# Altium project projet_pcb_F103.PrjPCB
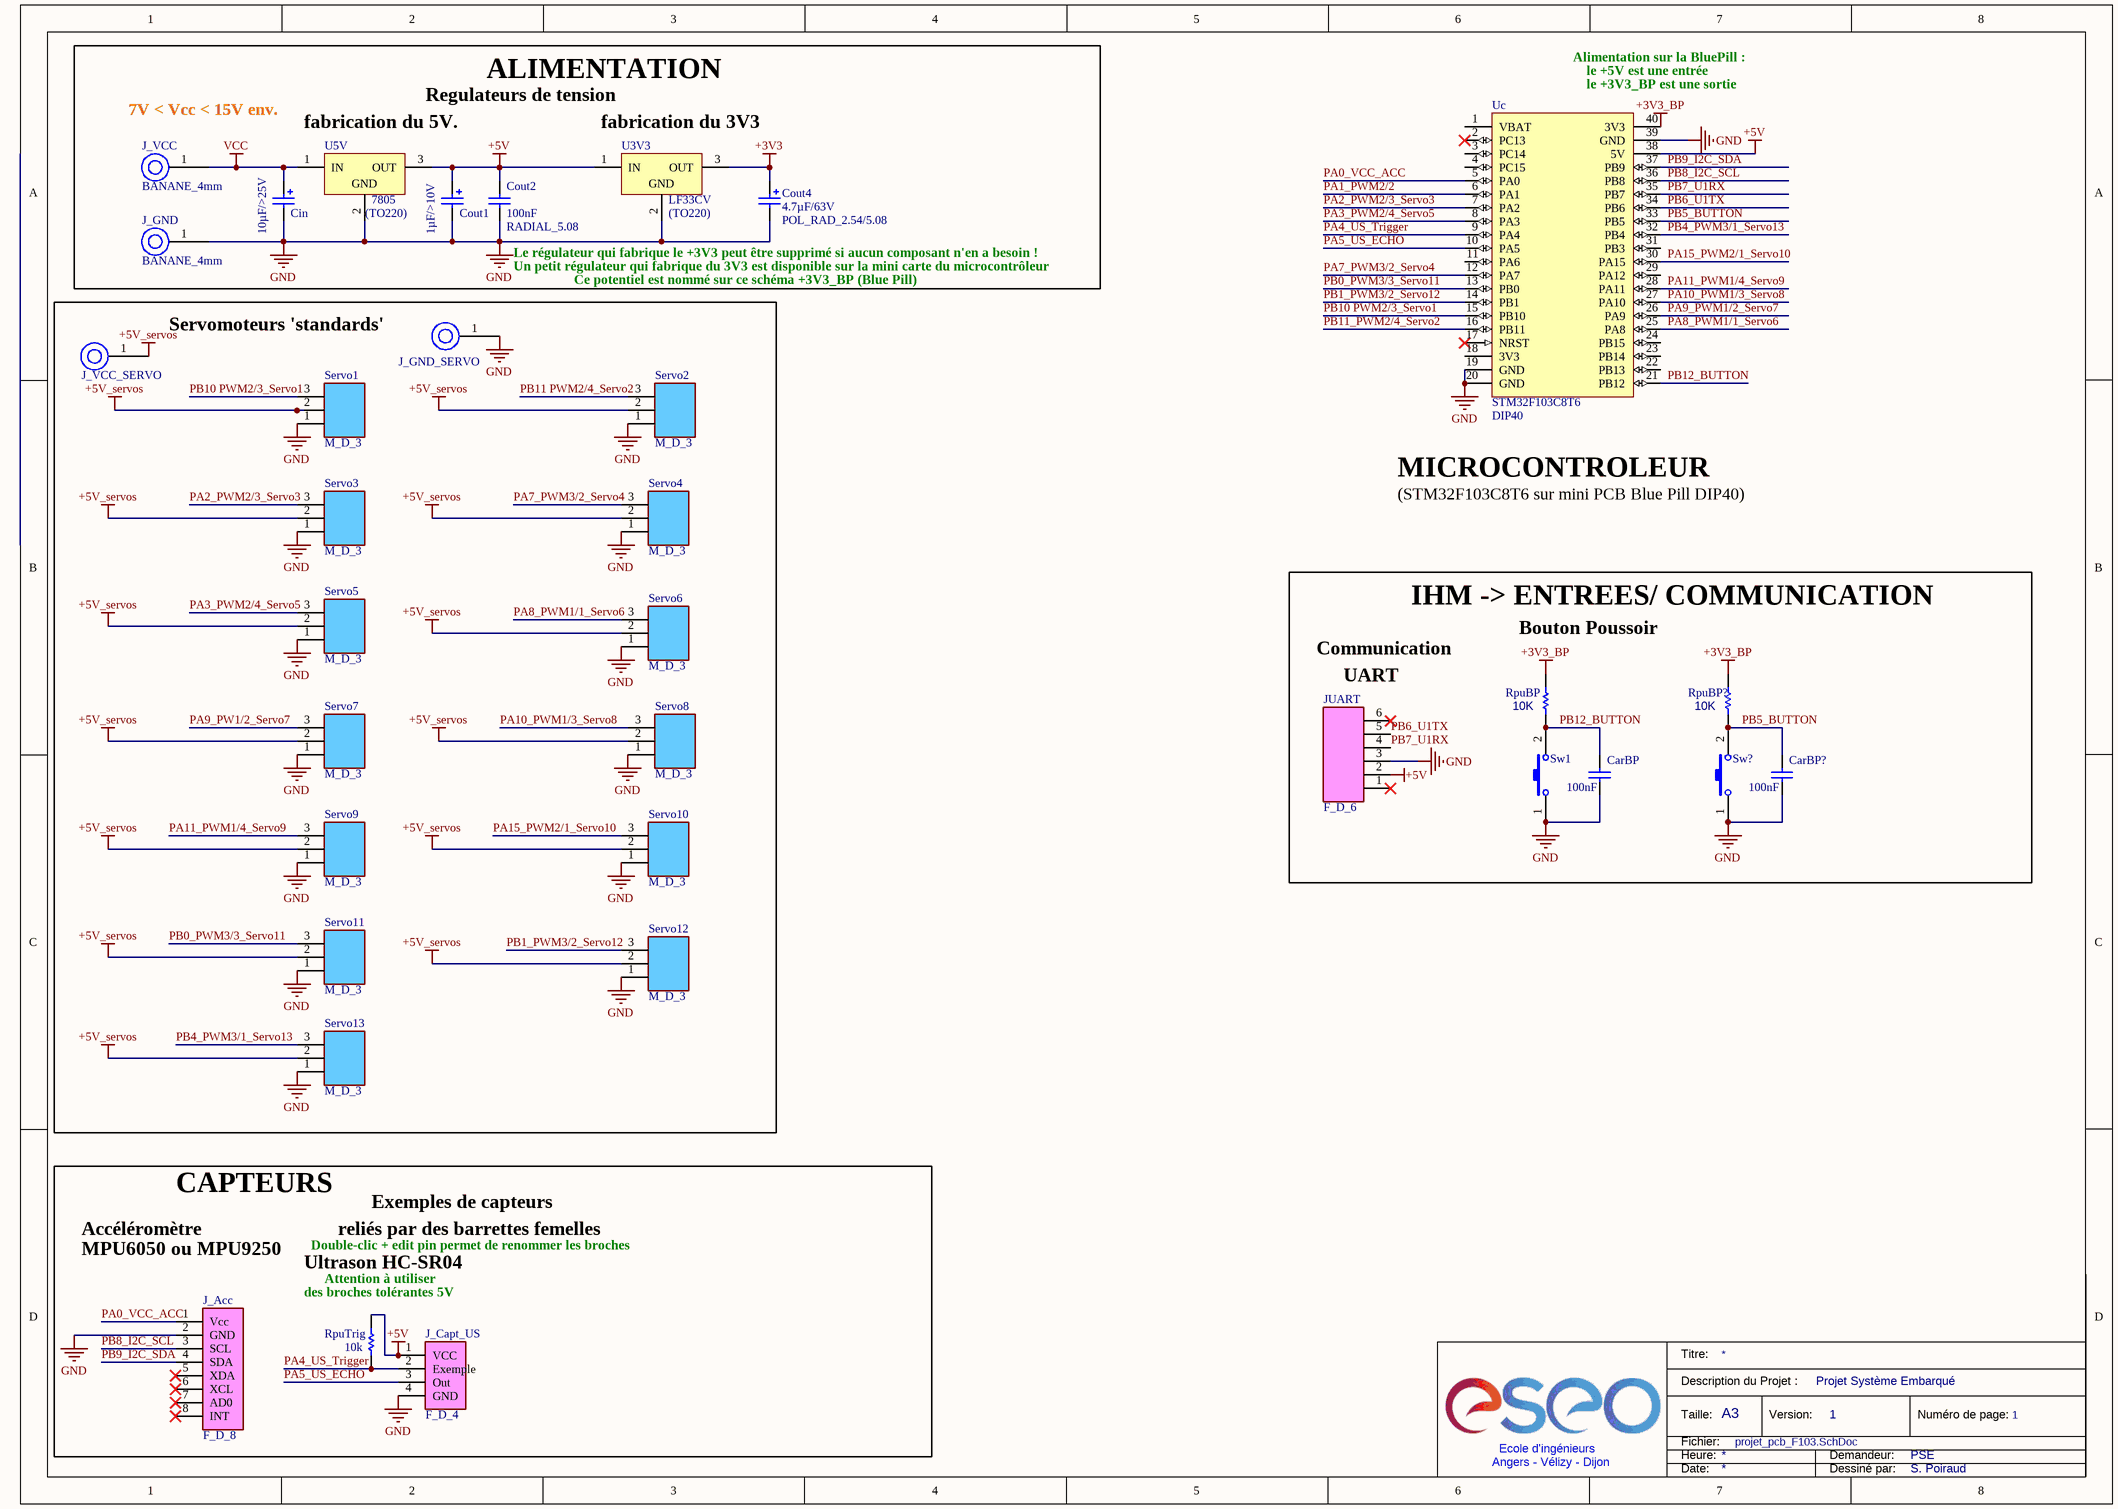
[diagram p0: projet_pcb_F103.SchDoc]
1 sheet, 34 parts. Net scope: global (net labels, ports and power ports of the same name join across sheets).
Board file: projet_pcb_F103.PCBDOC

## Sheet projet_pcb_F103.SchDoc
size A3

### Parts
CarBP  value 100nF  [CONDENSATEUR_CERAMIQUE_RADIAL_5.08]  (hidden comment: CONDENSATEUR_CER_RAD_5.08)
CarBP?  value 100nF  [CONDENSATEUR_CERAMIQUE_RADIAL_5.08]  (hidden comment: CONDENSATEUR_CER_RAD_5.08)
Cin  value 10µF/>25V  [CONDENSATEUR_POLARISE_ELECTROLYTIQUE_RADIAL_2.0/5.08]  (hidden comment: CONDENSATEUR_POL_ELECTROLY_RAD_2.0/5.08)
Cout1  value 1µF/>10V  [CONDENSATEUR_POLARISE_ELECTROLYTIQUE_RADIAL_2.0/5.08]  (hidden comment: CONDENSATEUR_POL_ELECTROLY_RAD_2.0/5.08)
Cout2  value 100nF  Type: RADIAL_5.08  [CONDENSATEUR_CERAMIQUE_RADIAL_5.08]  (hidden comment: CONDENSATEUR_CER_RAD_5.08)
Cout4  value 4.7µF/63V  Type: POL_RAD_2.54/5.08  [CONDENSATEUR_POLARISE_ELECTROLYTIQUE_RADIAL_2.54/5.08]  (hidden comment: CONDENSATEUR_POL_ELECTROLY_RAD_2.54/5.08)
J_Acc  Type: F_D_8  [BARRETTE_8_F_D]  (hidden comment: BARRETTE_8 CONTACTS_1 RANGEE_FEMELLE_DROITE)
J_Capt_US  Type: F_D_4  [BARRETTE_4_F_D]  (hidden comment: BARRETTE_4 CONTACTS_1 RANGEE_FEMELLE_DROITE)
J_GND  Type: BANANE_4mm  [DOUILLE_BANANE_4mm]  (hidden comment: DOUILLE BANANE 4mm)
J_GND_SERVO  DOUILLE BANANE 4mm  [DOUILLE_BANANE_4mm]  (value not drawn)
J_VCC  Type: BANANE_4mm  [DOUILLE_BANANE_4mm]  (hidden comment: DOUILLE BANANE 4mm)
J_VCC_SERVO  DOUILLE BANANE 4mm  [DOUILLE_BANANE_4mm]  (value not drawn)
JUART  Type: F_D_6  [BARRETTE_6_F_D]  (hidden comment: BARRETTE_6 CONTACTS_1 RANGEE_FEMELLE_DROITE)
RpuBP  value 10K  [RESISTANCE_1/4W]  (hidden comment: RESISTANCE_AXIALE_1/4W)
RpuBP?  value 10K  [RESISTANCE_1/4W]  (hidden comment: RESISTANCE_AXIALE_1/4W)
RpuTrig  10k  [RESISTANCE_1/4W]
Servo1  Type: M_D_3  [BARRETTE_3_M_D]  (hidden comment: BARRETTE 3 CONTACTS 1 RANGEE MALE DROITE)
Servo2  Type: M_D_3  [BARRETTE_3_M_D]  (hidden comment: BARRETTE 3 CONTACTS 1 RANGEE MALE DROITE)
Servo3  Type: M_D_3  [BARRETTE_3_M_D]  (hidden comment: BARRETTE 3 CONTACTS 1 RANGEE MALE DROITE)
Servo4  Type: M_D_3  [BARRETTE_3_M_D]  (hidden comment: BARRETTE 3 CONTACTS 1 RANGEE MALE DROITE)
Servo5  Type: M_D_3  [BARRETTE_3_M_D]  (hidden comment: BARRETTE 3 CONTACTS 1 RANGEE MALE DROITE)
Servo6  Type: M_D_3  [BARRETTE_3_M_D]  (hidden comment: BARRETTE 3 CONTACTS 1 RANGEE MALE DROITE)
Servo7  Type: M_D_3  [BARRETTE_3_M_D]  (hidden comment: BARRETTE 3 CONTACTS 1 RANGEE MALE DROITE)
Servo8  Type: M_D_3  [BARRETTE_3_M_D]  (hidden comment: BARRETTE 3 CONTACTS 1 RANGEE MALE DROITE)
Servo9  Type: M_D_3  [BARRETTE_3_M_D]  (hidden comment: BARRETTE 3 CONTACTS 1 RANGEE MALE DROITE)
Servo10  Type: M_D_3  [BARRETTE_3_M_D]  (hidden comment: BARRETTE 3 CONTACTS 1 RANGEE MALE DROITE)
Servo11  Type: M_D_3  [BARRETTE_3_M_D]  (hidden comment: BARRETTE 3 CONTACTS 1 RANGEE MALE DROITE)
Servo12  Type: M_D_3  [BARRETTE_3_M_D]  (hidden comment: BARRETTE 3 CONTACTS 1 RANGEE MALE DROITE)
Servo13  Type: M_D_3  [BARRETTE_3_M_D]  (hidden comment: BARRETTE 3 CONTACTS 1 RANGEE MALE DROITE)
Sw1  BOUTON_POUSSOIR_MINIATURE_TRAVERSANT  [BOUTON_POUSSE_PLAT_6x6]  (value not drawn)
Sw?  BOUTON_POUSSOIR_MINIATURE_TRAVERSANT  [BOUTON_POUSSE_PLAT_6x6]  (value not drawn)
U3V3  Type: LF33CV  Package: (TO220)  [REGULATEUR_TO220_78XX]  (hidden comment: REGULATEUR_TO220_78XX)
U5V  Type: 7805  Package: (TO220)  [REGULATEUR_TO220_78XX]  (hidden comment: REGULATEUR_TO220_78XX)
Uc  Type: STM32F103C8T6  Package: DIP40  [STM32F103C8T6_DIP40]  (hidden comment: STM32F103C8T6/PCB_DIP40)

### Blocks framed on the sheet
ALIMENTATION: Cin Cout1 Cout2 Cout4 J_GND J_VCC U3V3 U5V
Servomoteurs 'standards': J_GND_SERVO J_VCC_SERVO Servo1-Servo13
IHM -> ENTREES/ COMMUNICATION: CarBP CarBP? JUART RpuBP RpuBP? Sw1 Sw?
CAPTEURS: J_Acc J_Capt_US RpuTrig

### Nets
+3V3: Cout4.1 U3V3.3(OUT)
+3V3_BP: RpuBP.1 RpuBP?.1 Uc.40(3V3)
+5V: Cout1.1 Cout2.2 J_Capt_US.1(VCC) JUART.2 RpuTrig.2 U3V3.1(IN) U5V.3(OUT) Uc.38(5V)
+5V_servos: J_VCC_SERVO.1 Servo1.2 Servo2.2 Servo3.2 Servo4.2 Servo5.2 Servo6.2 Servo7.2 Servo8.2 Servo9.2 Servo10.2 Servo11.2 Servo12.2 Servo13.2
GND: CarBP.1 CarBP?.1 Cin.2 Cout1.2 Cout2.1 Cout4.2 J_Acc.2(GND) J_Capt_US.4(GND) J_GND.1 J_GND_SERVO.1 JUART.3 Servo1.1 Servo2.1 Servo3.1 Servo4.1 Servo5.1 Servo6.1 Servo7.1 Servo8.1 Servo9.1 Servo10.1 Servo11.1 Servo12.1 Servo13.1 Sw1.1 Sw?.1 U3V3.2(GND) U5V.2(GND) Uc.19(GND) Uc.20(GND) Uc.39(GND)
VCC: Cin.1 J_VCC.1 U5V.1(IN)
PA0_VCC_ACC: J_Acc.1(Vcc) Uc.5(PA0)
PA1_PWM2/2: Uc.6(PA1)
PA2_PWM2/3_Servo3: Servo3.3 Uc.7(PA2)
PA3_PWM2/4_Servo5: Servo5.3 Uc.8(PA3)
PA4_US_Trigger: J_Capt_US.2(Exemple) RpuTrig.1 Uc.9(PA4)
PA5_US_ECHO: J_Capt_US.3(Out) Uc.10(PA5)
PA7_PWM3/2_Servo4: Servo4.3 Uc.12(PA7)
PA8_PWM1/1_Servo6: Servo6.3 Uc.25(PA8)
PA9_PW1/2_Servo7: Servo7.3
PA9_PWM1/2_Servo7: Uc.26(PA9)
PA10_PWM1/3_Servo8: Servo8.3 Uc.27(PA10)
PA11_PWM1/4_Servo9: Servo9.3 Uc.28(PA11)
PA15_PWM2/1_Servo10: Servo10.3 Uc.30(PA15)
PB0_PWM3/3_Servo11: Servo11.3 Uc.13(PB0)
PB1_PWM3/2_Servo12: Servo12.3 Uc.14(PB1)
PB4_PWM3/1_Servo13: Servo13.3 Uc.32(PB4)
PB5_BUTTON: CarBP?.2 RpuBP?.2 Sw?.2 Uc.33(PB5)
PB6_U1TX: JUART.5 Uc.34(PB6)
PB7_U1RX: JUART.4 Uc.35(PB7)
PB8_I2C_SCL: J_Acc.3(SCL) Uc.36(PB8)
PB9_I2C_SDA: J_Acc.4(SDA) Uc.37(PB9)
PB10 PWM2/3_Servo1: Servo1.3 Uc.15(PB10)
PB11 PWM2/4_Servo2: Servo2.3
PB11_PWM2/4_Servo2: Uc.16(PB11)
PB12_BUTTON: CarBP.2 RpuBP.2 Sw1.2 Uc.21(PB12)

Not connected (* = marked no-connect by the designer): J_Acc 5(XDA)* 6(XCL)* 7(AD0)* 8(INT)*; JUART 1* 6*; Uc 1(VBAT) 2(PC13)* 3(PC14) 4(PC15) 11(PA6) 17(NRST)* 18(3V3) 22(PB13) 23(PB14) 24(PB15) 29(PA12) 31(PB3)

### Notes on the sheet
- Regulateurs de tension
- Alimentation sur la BluePill :
- (near Uc) le +3V3_BP est une sortie
- (near Uc) le +5V est une entrée
- 7V < Vcc < 15V env.
- (near U5V) fabrication du 5V.
- (near U3V3) fabrication du 3V3
- Le régulateur qui fabrique le +3V3 peut être supprimé si aucun composant n'en a besoin !
- Un petit régulateur qui fabrique du 3V3 est disponible sur la mini carte du microcontrôleur
- Ce potentiel est nommé sur ce schéma +3V3_BP (Blue Pill)
- MICROCONTROLEUR
- (STM32F103C8T6 sur mini PCB Blue Pill DIP40)
- (near RpuBP) Bouton Poussoir
- Communication
- (near JUART) UART
- Accéléromètre
- MPU6050 ou MPU9250
- Double-clic + edit pin permet de renommer les broches
- reliés par des barrettes femelles
- Exemples de capteurs
- Ultrason HC-SR04
- (near RpuTrig) des broches tolérantes 5V
- (near RpuTrig) Attention à utiliser
- Titre:
- Description du Projet :
- Projet Système Embarqué
- Ecole d'ingénieurs
- Taille:
- Heure:
- Fichier:
- A3
- Version:
- 1
- Demandeur:
- PSE
- Numéro de page:
- Angers - Vélizy - Dijon
- Date:
- Dessiné par:
- S. Poiraud

### Library data of the parts
CarBP CarBP? Cout2 = CONDENSATEUR_CER_RAD_5.08: CONDENSATEUR TRAVERSANT CERAMIQUE RADIAL 5.08mm
  CarBP CarBP?: Type: RADIAL_5.08
Cin Cout1 = CONDENSATEUR_POL_ELECTROLY_RAD_2.0/5.08: CONDENSATEUR POLARISE ELECTROLYTIQUE RADIAL 2.0/5.08; Type: POL_RAD_2.0/5.08
Cout4 = CONDENSATEUR_POL_ELECTROLY_RAD_2.54/5.08: CONDENSATEUR POLARISE ELECTROLYTIQUE RADIAL 2.54/5.08
J_Capt_US = BARRETTE_4 CONTACTS_1 RANGEE_FEMELLE_DROITE: BARRETTE 4 CONTACTS 1 RANGEE FEMELLE DROITE
J_GND J_GND_SERVO J_VCC J_VCC_SERVO = DOUILLE_BANANE_4mm: DOUILLE BANANE 4 mm
  J_GND_SERVO J_VCC_SERVO: Type: BANANE_4mm
JUART = BARRETTE_6 CONTACTS_1 RANGEE_FEMELLE_DROITE: BARRETTE 6 CONTACTS 1 RANGEE FEMELLE DROITE
RpuBP RpuBP? = RESISTANCE_AXIALE_1/4W: RESISTANCE TRAVERSANTE AXIALE 1/4W; Type: 1/4W
RpuTrig = Resistor: Published: 8-Jun-2000; LatestRevisionDate: 17-Jul-2002; LatestRevisionNote: Re-released for DXP Platform.; PackageReference: AXIAL-0.5; Publisher: Altium Limited
Servo1-Servo13 = BARRETTE_3 CONTACTS_1 RANGEE_MALE_DROITE
Sw1 Sw? = BOUTON_POUSSOIR_MINIATURE_TRAVERSANT: BOUTON POUSSOIR MINIATURE TRAVERSANT ON/OFF; Type: B_POUSS_MINI_T
U3V3 U5V = REGULATEUR_TO220_78XX: REGULATEUR DE TENSION POSITIVE 78XX BOITIER TO220
Uc = STM32F103C8T6/PCB_DIP40: MICROCONTROLEUR 32 BITS - 72MHz - 34 I/O - 64 KO : FLASH - 20KO RAM - 10 CANAUX A/D 12 BITS - DIP40 - UART, SPI, I2C, USB, CAN